# Altium schematic sheet Cameras_v3.SchDoc: ds
size A4; Author: Luis Sanchez
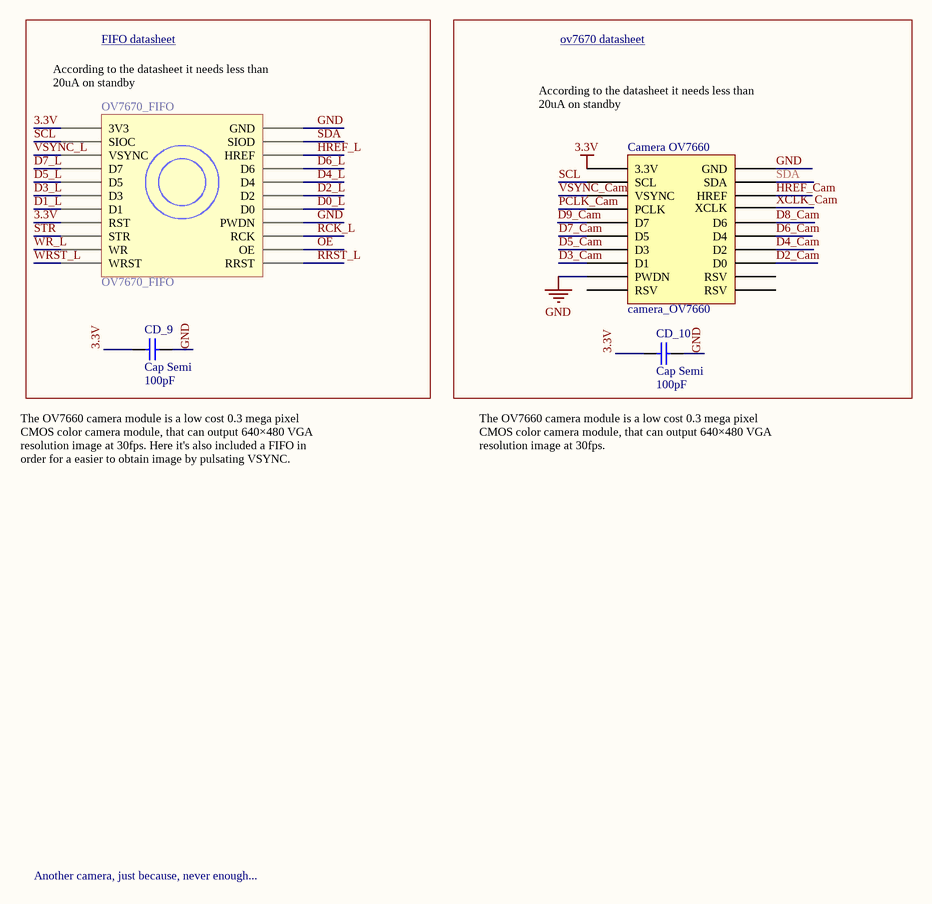
[diagram p0: Cameras_v3.SchDoc]

## Parts
Camera_OV7660  camera_OV7660  [CAMERA_OV7660 - high - Pins]
CD_9  Cap Semi  value 100pF  [C1206]
CD_10  Cap Semi  value 100pF  [C1206]
OV7670_FIFO  OV7670_FIFO  [OV7670_FIFO_SIDE_PINS]

## Nets
3.3V: Camera_OV7660.3V3(3.3V) CD_9.2 CD_10.2 OV7670_FIFO.3V3 OV7670_FIFO.RST
GND: Camera_OV7660.GND Camera_OV7660.PWDN CD_9.1 CD_10.1 OV7670_FIFO.GND OV7670_FIFO.PWDN
D0_L: OV7670_FIFO.D0
D1_L: OV7670_FIFO.D1
D2_Cam: Camera_OV7660.D0
D2_L: OV7670_FIFO.D2
D3_Cam: Camera_OV7660.D1
D3_L: OV7670_FIFO.D3
D4_Cam: Camera_OV7660.D2
D4_L: OV7670_FIFO.D4
D5_Cam: Camera_OV7660.D3
D5_L: OV7670_FIFO.D5
D6_Cam: Camera_OV7660.D4
D6_L: OV7670_FIFO.D6
D7_Cam: Camera_OV7660.D5
D7_L: OV7670_FIFO.D7
D8_Cam: Camera_OV7660.D6
D9_Cam: Camera_OV7660.D7
HREF_Cam: Camera_OV7660.HREF
HREF_L: OV7670_FIFO.HREF
OE: OV7670_FIFO.OE
PCLK_Cam: Camera_OV7660.PCLK
RCK_L: OV7670_FIFO.RCK
RRST_L: OV7670_FIFO.RRST
SCL: Camera_OV7660.SCL OV7670_FIFO.SIOC
SDA: Camera_OV7660.SDA OV7670_FIFO.SIOD
STR: OV7670_FIFO.STR
VSYNC_Cam: Camera_OV7660.VSYNC
VSYNC_L: OV7670_FIFO.VSYNC
WR_L: OV7670_FIFO.WR
WRST_L: OV7670_FIFO.WRST
XCLK_Cam: Camera_OV7660.XCLK

Not connected (* = marked no-connect by the designer): Camera_OV7660 RSV1(RSV) RSV2(RSV) RSV3(RSV)

## Notes on the sheet
- FIFO datasheet <http://pdf.datasheetcatalog.com/datasheet_pdf/averlogic/AL422B_to_AL422V5.pdf>
- ov7670 datasheet <https://www.google.es/url?sa=t&rct=j&q=&esrc=s&source=web&cd=1&cad=rja&uact=8&ved=0ahUKEwjE_oyJ0fHQAhXBwxQKHW1WAqAQFggaMAA&url=http%3A%2F%2Fwww.voti.nl%2Fdocs%2FOV7670.pdf&usg=AFQjCNFZs22p24OHLYQDSxcX4L-THKJapg&sig2=-_yu5A4AcAny_Nl69trFig&bvm=bv.141320020,d.d24>
- (near OV7670_FIFO) According to the datasheet it needs less than 20uA on standby
- According to the datasheet it needs less than 20uA on standby
- The OV7660 camera module is a low cost 0.3 mega pixel CMOS color camera module, that can output 640×480 VGA resolution image at 30fps. Here it's also included a FIFO in order for a easier to obtain image by pulsating VSYNC. FIFO outputs 3.3V which os not enough for an arduino
- The OV7660 camera module is a low cost 0.3 mega pixel CMOS color camera module, that can output 640×480 VGA resolution image at 30fps.
- Another camera, just because, never enough...
- Designer's signature
- Sheet title:
- Dpto. Electrónica y Tecnología
- de Computadores
- Supervisor's signature
- Project title:
- Desginer:
- University of Granada
- C/ Fuente Nueva, s/n, 18001
- Granada, Granada, Spain
- Sr. Andrés Roldán Aranda
- Date:
- Revision:
- Sheet
- of

## Library data of the parts
CD_9 CD_10 = Cap Semi: Capacitor (Semiconductor SIM Model); Published: 8-Jun-2000; LatestRevisionDate: 29-May-2009; LatestRevisionNote: IPC-7351 Footprint Added.; PackageReference: C1206; Publisher: Altium Limited; PackageDescription: Chip Capacitor; Supplier 1: Digi-Key
OV7670_FIFO = OV7670_FIFO_FRONT_PINS